# Altium schematic sheet Sensor.SchDoc
size A4; SheetNumber: 2; SheetTotal: 2
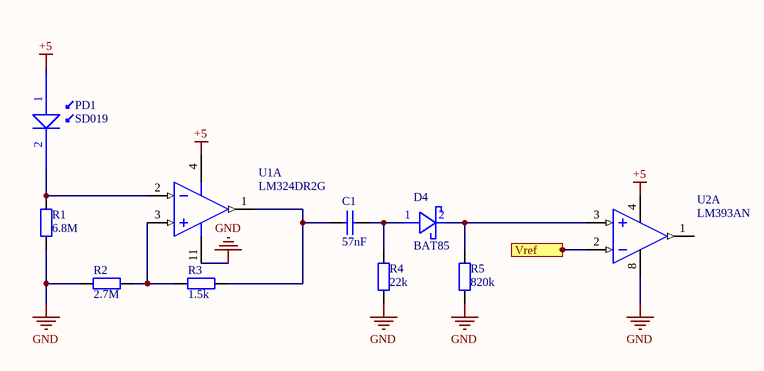
[diagram p0: Sensor.SchDoc]

## Parts
C1  57nF  [0805 CAP]
D4  BAT85  [BAT85]
PD1  SD019  [SD019]
R1  6.8M  [0805 RES]
R2  2.7M  [0805 RES]
R3  1.5k  [0805 RES]
R4  22k  [0805 RES]
R5  820k  [0805 RES]
U1  LM324DR2G  [SOIC-14]  (part A of 4)
U2  LM393AN  [ECE-DIP8]  (part A of 2)

## Ports
Vref (in)

## Nets
+5: PD1.1 U1.4(VCC) U2.4(GND)
GND: R1.1 R2.2 R4.1 R5.1 U1.11(VEE/GND) U2.8(V+)
Vref: U2.2(IN-) ; port Vref
NetC1_1: C1.1 R3.2 U1.1(OUT1)
NetC1_2: C1.2 D4.1 R4.2
NetD4_2: D4.2 R5.2 U2.3(IN+)
NetPD1_2: PD1.2 R1.2 U1.2(IN1-)
NetR2_1: R2.1 R3.1 U1.3(IN1+)

Not connected (* = marked no-connect by the designer): U2 1(OUT)

## Library data of the parts
C1 = CerCap_SMT_0805: SMT ceramic capacitor 0805 size; Value: *
R1-R5 = Res_SMT_0805: 0805 resistor; Published: 8-Jun-2000; LatestRevisionDate: 17-Jul-2002; LatestRevisionNote: Re-released for DXP Platform.; PackageReference: AXIAL-0.4; Publisher: Altium Limited; Value: *; ComponentLink1Description: https://nz.mouser.com/datasheet/2/315/AOA0000C304-1149620.pdf
U1 = LM324DR_SMT_SOIC16: Single Supply Quad Operational Amplifier, 3 to 32 V, 0 to 70 degC, 14-Pin SOIC, Pb-Free, Tape and Reel; Manufacturer: On Semiconductor; VCC Max (V): 32; VCC Min (V): 3; PackageVersion: Rev. K, 05/2011; ComponentLink3URL: http://www.onsemi.com/pub_link/Collateral/751A-03.PDF; ComponentLink3Description: Package Specification; Packing: Tape and Reel; ComponentLink2URL: http://www.onsemi.cn/pub_link/Collateral/LM324-D.PDF; PackageReference: SOIC-14-751A-03; ComponentLink1URL: http://www.onsemi.com/; PackageDescription: 14-Pin Small Outline Integrated Circuit, Body 8.65 x 3.9 mm, Pitch 1.27 mm; ComponentLink1Description: Manufacturer URL; DatasheetVersion: Rev. 25; Mounting Technology: Surface Mount; RoHS: TRUE; ComponentLink2Description: Datasheet; PartNumber: LM324DR2G
U2 = LM393AN: Dual Comparator; Published: 17-Jul-2002; LatestRevisionDate: 06-Jun-2005; LatestRevisionNote: Stylized 3D Model Added.; DatasheetVersion: 1988; PackageReference: 626-05; Publisher: Altium Limited; PackageDescription: DIP; 8 Leads; Row Spacing 7.62 mm; Pitch 2.54 mm; ComponentLink1Description: Manufacturer Link; ComponentLink1URL: http://www.onsemi.com/site/products/taxonomy/0,4438,133,00.html